# Altium schematic sheet Sheet1.SchDoc
size A3
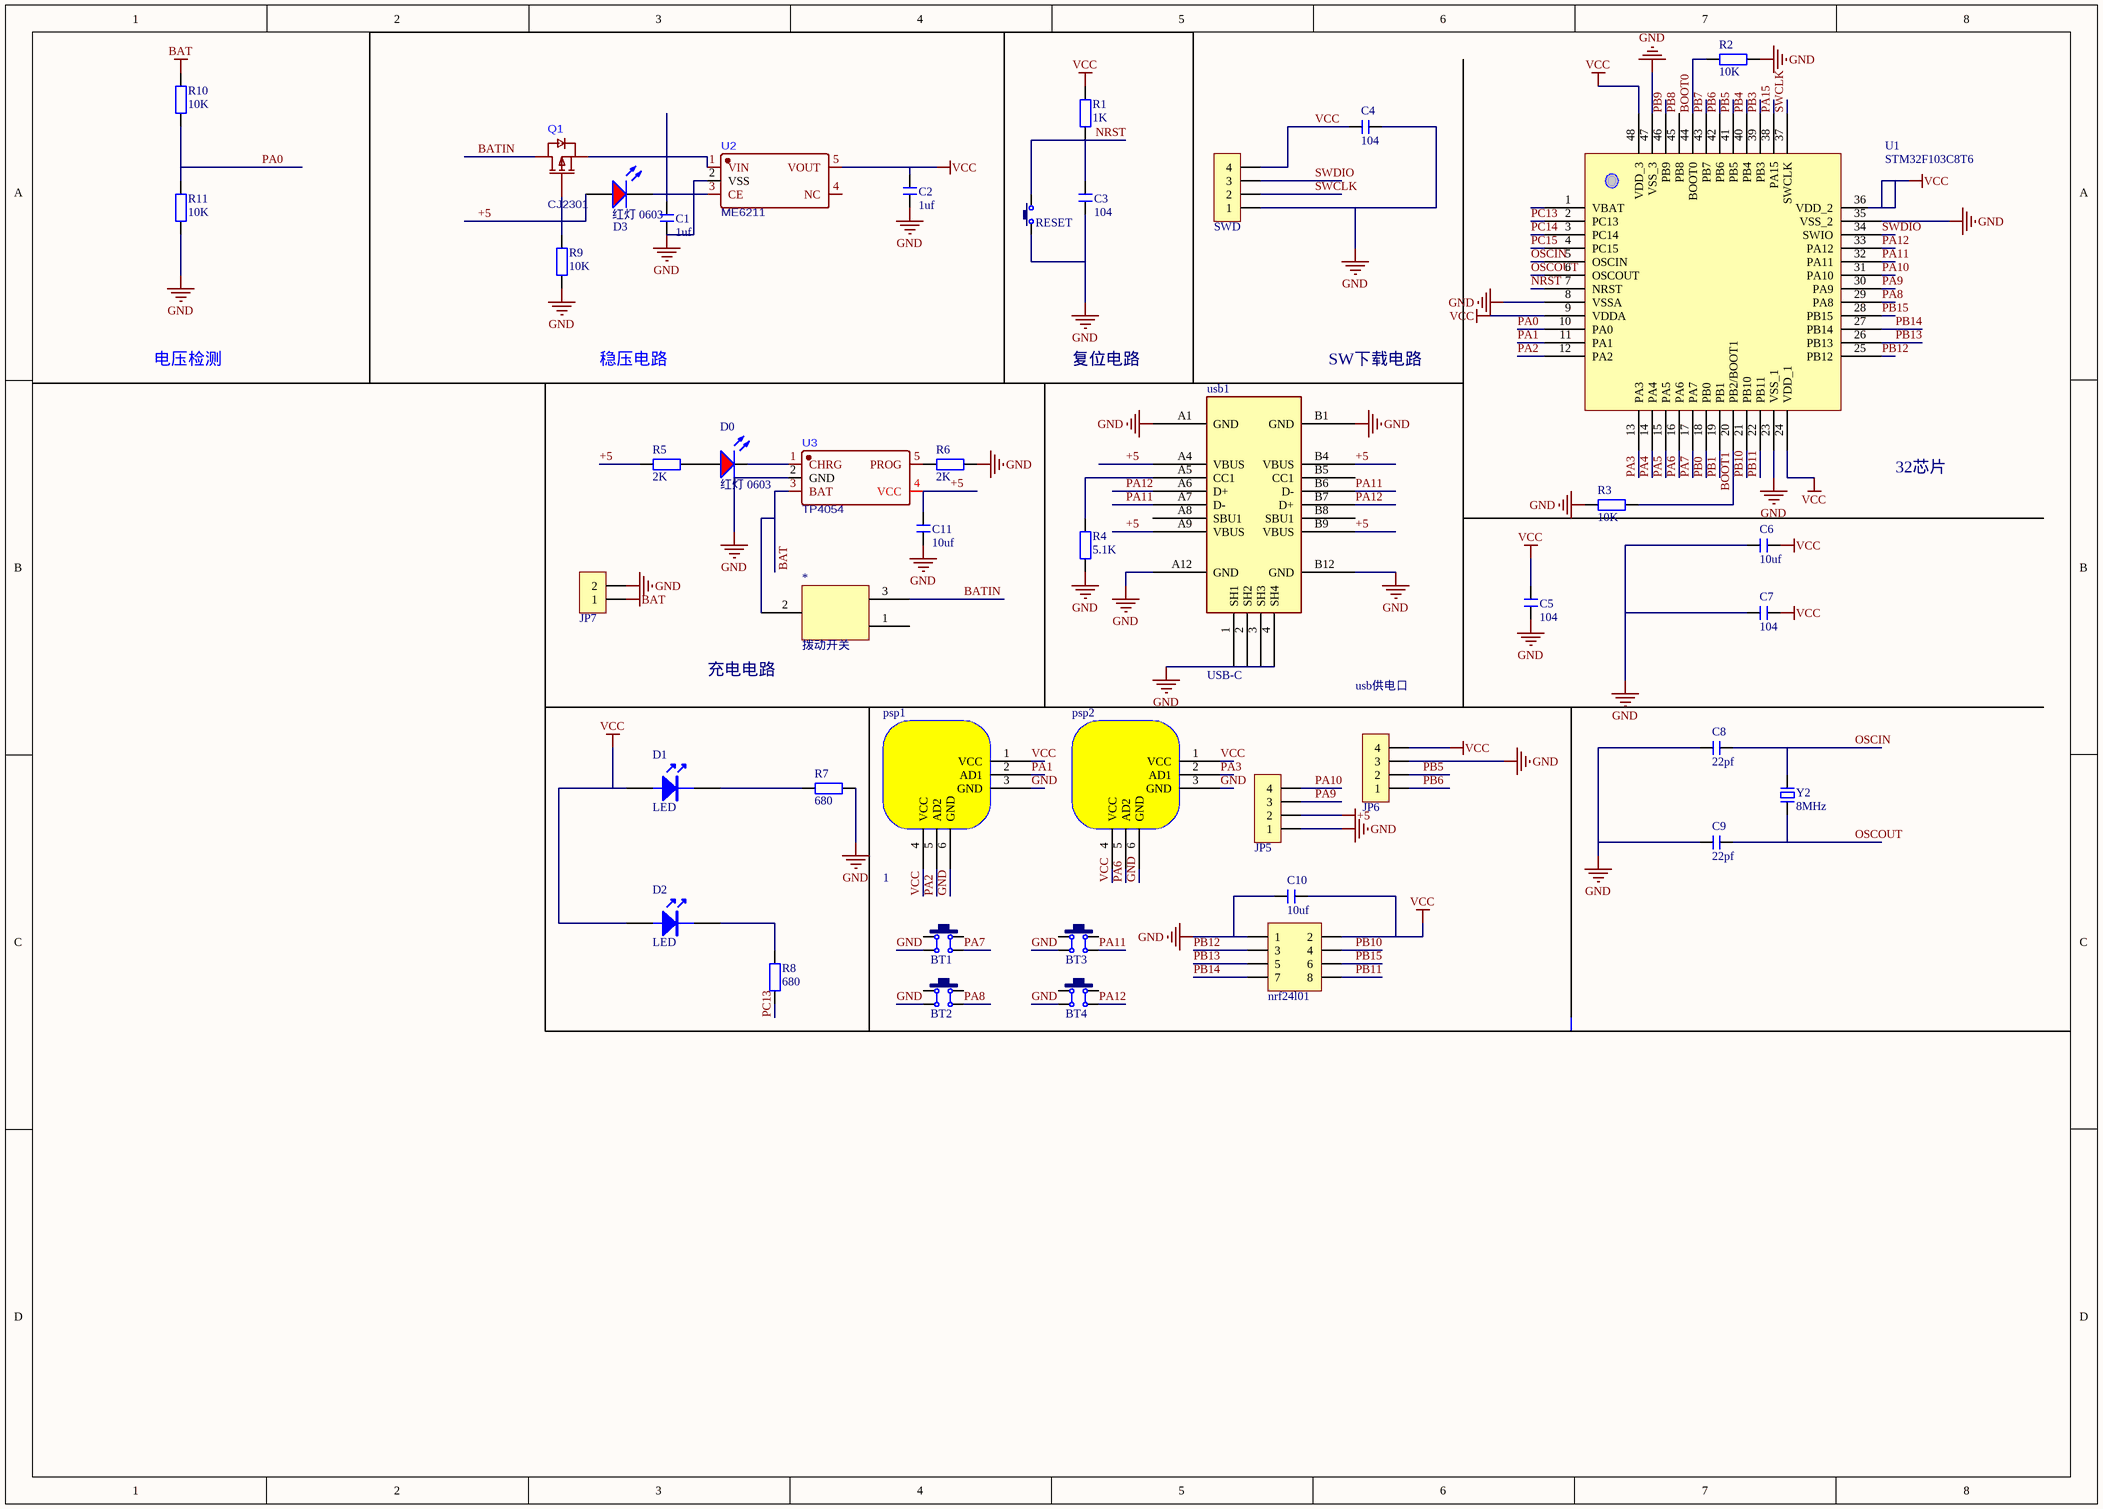
[diagram p0: Sheet1.SchDoc]

## Parts
*  拨动开关  [SS-12F23]
BT1  6x6x5  [TSW DIP-6*6*6]  (value not drawn)
BT2  6x6x5  [TSW DIP-6*6*6]  (value not drawn)
BT3  6x6x5  [TSW DIP-6*6*6]  (value not drawn)
BT4  6x6x5  [TSW DIP-6*6*6]  (value not drawn)
C1  1uf  [C 0603_L]
C2  1uf  [C 0603_L]
C3  104  [C 0603_L]
C4  104  [C 0603_L]
C5  104  [C 0603_L]
C6  10uf  [C 0603_L]
C7  104  [C 0603_L]
C8  22pf  [C 0603_L]
C9  22pf  [C 0603_L]
C10  10uf  [C 0603_L]
C11  10uf  [C 0603_L]
D0  红灯 0603  [LC-0603_LED_S1]
D1  LED  [LED 0805G]
D2  LED  [LED 0805G]
D3  红灯 0603  [LC-0603_LED_S1]
JP5  HDR-1X4  [HDR2.54-M-LI-4P]  (value not drawn)
JP6  HDR-1X4  [HDR2.54-M-LI-4P]  (value not drawn)
JP7  HDR-1X2  [XH2.54-WI-2P]  (value not drawn)
nrf24l01  Header 4X2  [HDR2.54-LI-2x4P]  (value not drawn)
psp1  1  [PSP摇杆]
psp2  (no value)  [PSP摇杆]
Q1  CJ2301  [CJ2301]
R1  1K  [R 0603_L]
R2  10K  [R 0603_L]
R3  10K  [R 0603_L]
R4  5.1K  [R 0603_L]
R5  2K  [R 0603_L]
R6  2K  [R 0603_L]
R7  680  [R 0603_L]
R8  680  [R 0603_L]
R9  10K  [R 0603_L]
R10  10K  [R 0603_L]
R11  10K  [R 0603_L]
RESET  3x6x5  [TSW SMD-3*6*2.5]  (value not drawn)
SWD  HDR-1X4  [HDR2.54-WI-4P]  (value not drawn)
U1  STM32F103C8T6  [TQFP48 7x7_L]
U2  ME6211  [SOT23-5]
U3  TP4054  [SOT23-5]
usb1  USB-C  [USB-C]
Y2  8MHz  [OSC HC-49S]

## Nets
+5: C11.2 D3.A JP5.2 Q1.1(G) R5.1 R9.2 U3.4(VCC) usb1.A4(VBUS) usb1.A9(VBUS) usb1.B4(VBUS) usb1.B9(VBUS)
BAT: *.2 JP7.1 R10.2 U3.3(BAT)
GND: BT1.4 BT2.4 BT3.4 BT4.4 C1.1 C2.1 C3.1 C4.1 C5.1 C6.2 C7.2 C8.1 C9.1 C10.1 C11.1 JP5.1 JP6.3 JP7.2 nrf24l01.1 psp1.3(GND) psp1.6(GND) psp2.3(GND) psp2.6(GND) R2.2 R3.1 R4.1 R6.2 R7.1 R9.1 R11.1 RESET.1 SWD.1 U1.8(VSSA) U1.23(VSS_1) U1.35(VSS_2) U1.47(VSS_3) U2.2(VSS) U3.2(GND) usb1.1(SH1) usb1.2(SH2) usb1.3(SH3) usb1.4(SH4) usb1.A1(GND) usb1.A12(GND) usb1.B1(GND) usb1.B12(GND)
VCC: C2.2 C4.2 C5.2 C6.1 C7.1 C10.2 D1.1 D2.1 JP6.4 nrf24l01.2 psp1.1(VCC) psp1.4(VCC) psp2.1(VCC) psp2.4(VCC) R1.2 SWD.4 U1.9(VDDA) U1.24(VDD_1) U1.36(VDD_2) U1.48(VDD_3) U2.5(VOUT)
BATIN: *.3 Q1.3(D)
BOOT0: R2.1 U1.44(BOOT0)
BOOT1: R3.2 U1.20(PB2/BOOT1)
NRST: C3.2 R1.1 RESET.2 U1.7(NRST)
OSCIN: C8.2 U1.5(OSCIN) Y2.2
OSCOUT: C9.2 U1.6(OSCOUT) Y2.1
PA0: R10.1 R11.2 U1.10(PA0)
PA1: psp1.2(AD1) U1.11(PA1)
PA2: psp1.5(AD2) U1.12(PA2)
PA3: psp2.2(AD1) U1.13(PA3)
PA4: U1.14(PA4)
PA5: U1.15(PA5)
PA6: psp2.5(AD2) U1.16(PA6)
PA7: BT1.3 U1.17(PA7)
PA8: BT2.3 U1.29(PA8)
PA9: JP5.3 U1.30(PA9)
PA10: JP5.4 U1.31(PA10)
PA11: BT3.3 U1.32(PA11) usb1.A7(D-) usb1.B6(D-)
PA12: BT4.3 U1.33(PA12) usb1.A6(D+) usb1.B7(D+)
PA15: U1.38(PA15)
PB0: U1.18(PB0)
PB1: U1.19(PB1)
PB3: U1.39(PB3)
PB4: U1.40(PB4)
PB5: JP6.2 U1.41(PB5)
PB6: JP6.1 U1.42(PB6)
PB7: U1.43(PB7)
PB8: U1.45(PB8)
PB9: U1.46(PB9)
PB10: nrf24l01.4 U1.21(PB10)
PB11: nrf24l01.8 U1.22(PB11)
PB12: nrf24l01.3 U1.25(PB12)
PB13: nrf24l01.5 U1.26(PB13)
PB14: nrf24l01.7 U1.27(PB14)
PB15: nrf24l01.6 U1.28(PB15)
PC13: R8.2 U1.2(PC13)
PC14: U1.3(PC14)
PC15: U1.4(PC15)
SWCLK: SWD.2 U1.37(SWCLK)
SWDIO: SWD.3 U1.34(SWIO)
NetC1_2: C1.2 D3.K Q1.2(S) U2.1(VIN) U2.3(CE)
NetD0_A: D0.A R5.2
NetD0_K: D0.K U3.1(CHRG)
NetD1_2: D1.2 R7.2
NetD2_2: D2.2 R8.1
NetR4_2: R4.2 usb1.A5(CC1)
NetR6_1: R6.1 U3.5(PROG)

Not connected (* = marked no-connect by the designer): * 1; BT1 1 2; BT2 1 2; BT3 1 2; BT4 1 2; U1 1(VBAT); U2 4(NC); usb1 A8(SBU1) B5(CC1) B8(SBU1)

## Notes on the sheet
- 电压检测
- 稳压电路
- 复位电路
- SW下载电路
- 32芯片
- 充电电路
- usb供电口

## Library data of the parts
BT1-BT4 = TSW DIP-6x6: 直插6x6轻触开关; 版权归属: 封装库来自淘宝 ID：黄晶宝石; BOM名称: 直插6x6轻触开关; 唯一出售店铺网址: https://shop463601444.taobao.com
C1-C11 = C: 贴片电容; BOM名称: 无极性贴片电容; 淘宝ID: 封装库来自淘宝 ID：黄晶宝石; 联系售后，技术支持: https://shop463601444.taobao.com; 唯一出售店铺网址: https://shop463601444.taobao.com
D0 D3 = 0603 红灯: 发光二极管; ComponentLink1Description: 供应商链接; ComponentLink1URL: http://www.szlcsc.com/product/details_2659.html; Package: 0603; Supplier: LC; SuppliersPartNumber: C2286
JP5 JP6 SWD = Header 4: 4P接插件; 版权归属: 封装库来自淘宝 ID：黄晶宝石; BOM名称: 4P接插件; 学习资源: https://shop463601444.taobao.com
JP7 = Header 2: 2P接插件; 版权归属: 封装库来自淘宝 ID：黄晶宝石; BOM名称: 2P接插件; 联系售后: https://shop463601444.taobao.com
nrf24l01 = Header 4X2: 4*2P接插件; 版权归属: 封装库来自淘宝 ID：黄晶宝石; BOM名称: 4*2P接插件; 学习资源: https://shop463601444.taobao.com
psp1 psp2 = PSP摇杆
R1-R11 = R: 贴片电阻; 版权归属: 来自淘宝 ID：黄晶宝石; 封装库来自淘宝卖家 ID：黄晶宝石: 其他店铺购入均为盗版，不享受售后技术支持服务，请立即申请退款; BOM名称: 贴片电阻; 联系售后: https://shop463601444.taobao.com
RESET = TSW 3x6: 3x6轻触开关; 版权归属: 封装库来自淘宝 ID：黄晶宝石; BOM名称: 3x6轻触开关; 学习资源: https://shop463601444.taobao.com
U2 = ME6211C25M5G-N
Y2 = XTAL-2P: 2脚无源脚晶振; 版权归属: 封装库来自淘宝卖家 ID：黄晶宝石; BOM名称: 2脚无源脚晶振; 学习资源: https://shop463601444.taobao.com